# Altium schematic sheet MainSchema.SchDoc
size A4
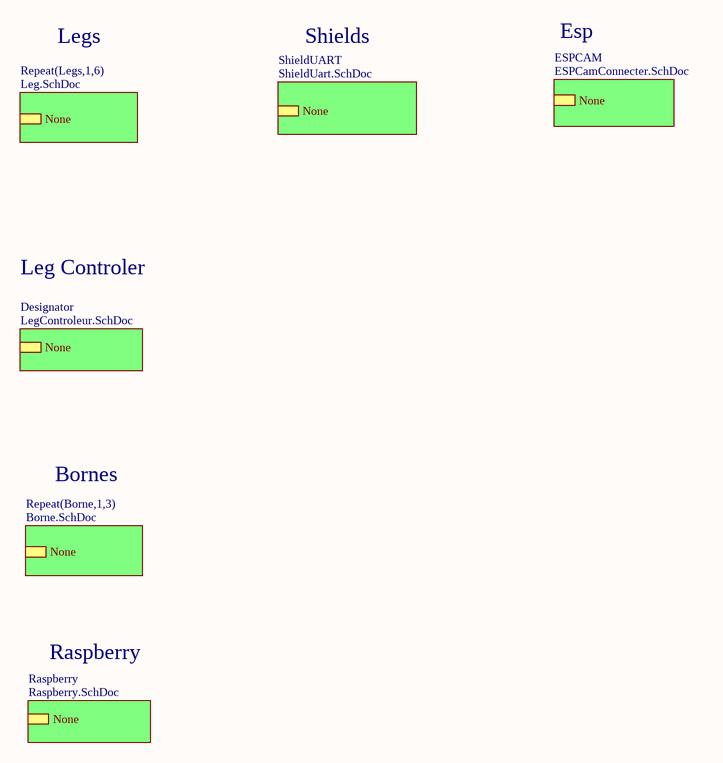
[diagram p0: MainSchema.SchDoc]

## Sub-sheets
Designator = LegControleur.SchDoc: None
ESPCAM = ESPCamConnecter.SchDoc: None
Raspberry = Raspberry.SchDoc: None
Repeat(Borne,1,3) = Borne.SchDoc: None
Repeat(Legs,1,6) = Leg.SchDoc: None
ShieldUART = ShieldUart.SchDoc: None

## Notes on the sheet
- Legs
- Shields
- Esp
- Leg Controler
- Bornes
- Raspberry